# Altium schematic sheet AnanasSTM32.SchDoc: AnanasSTM32
size A3
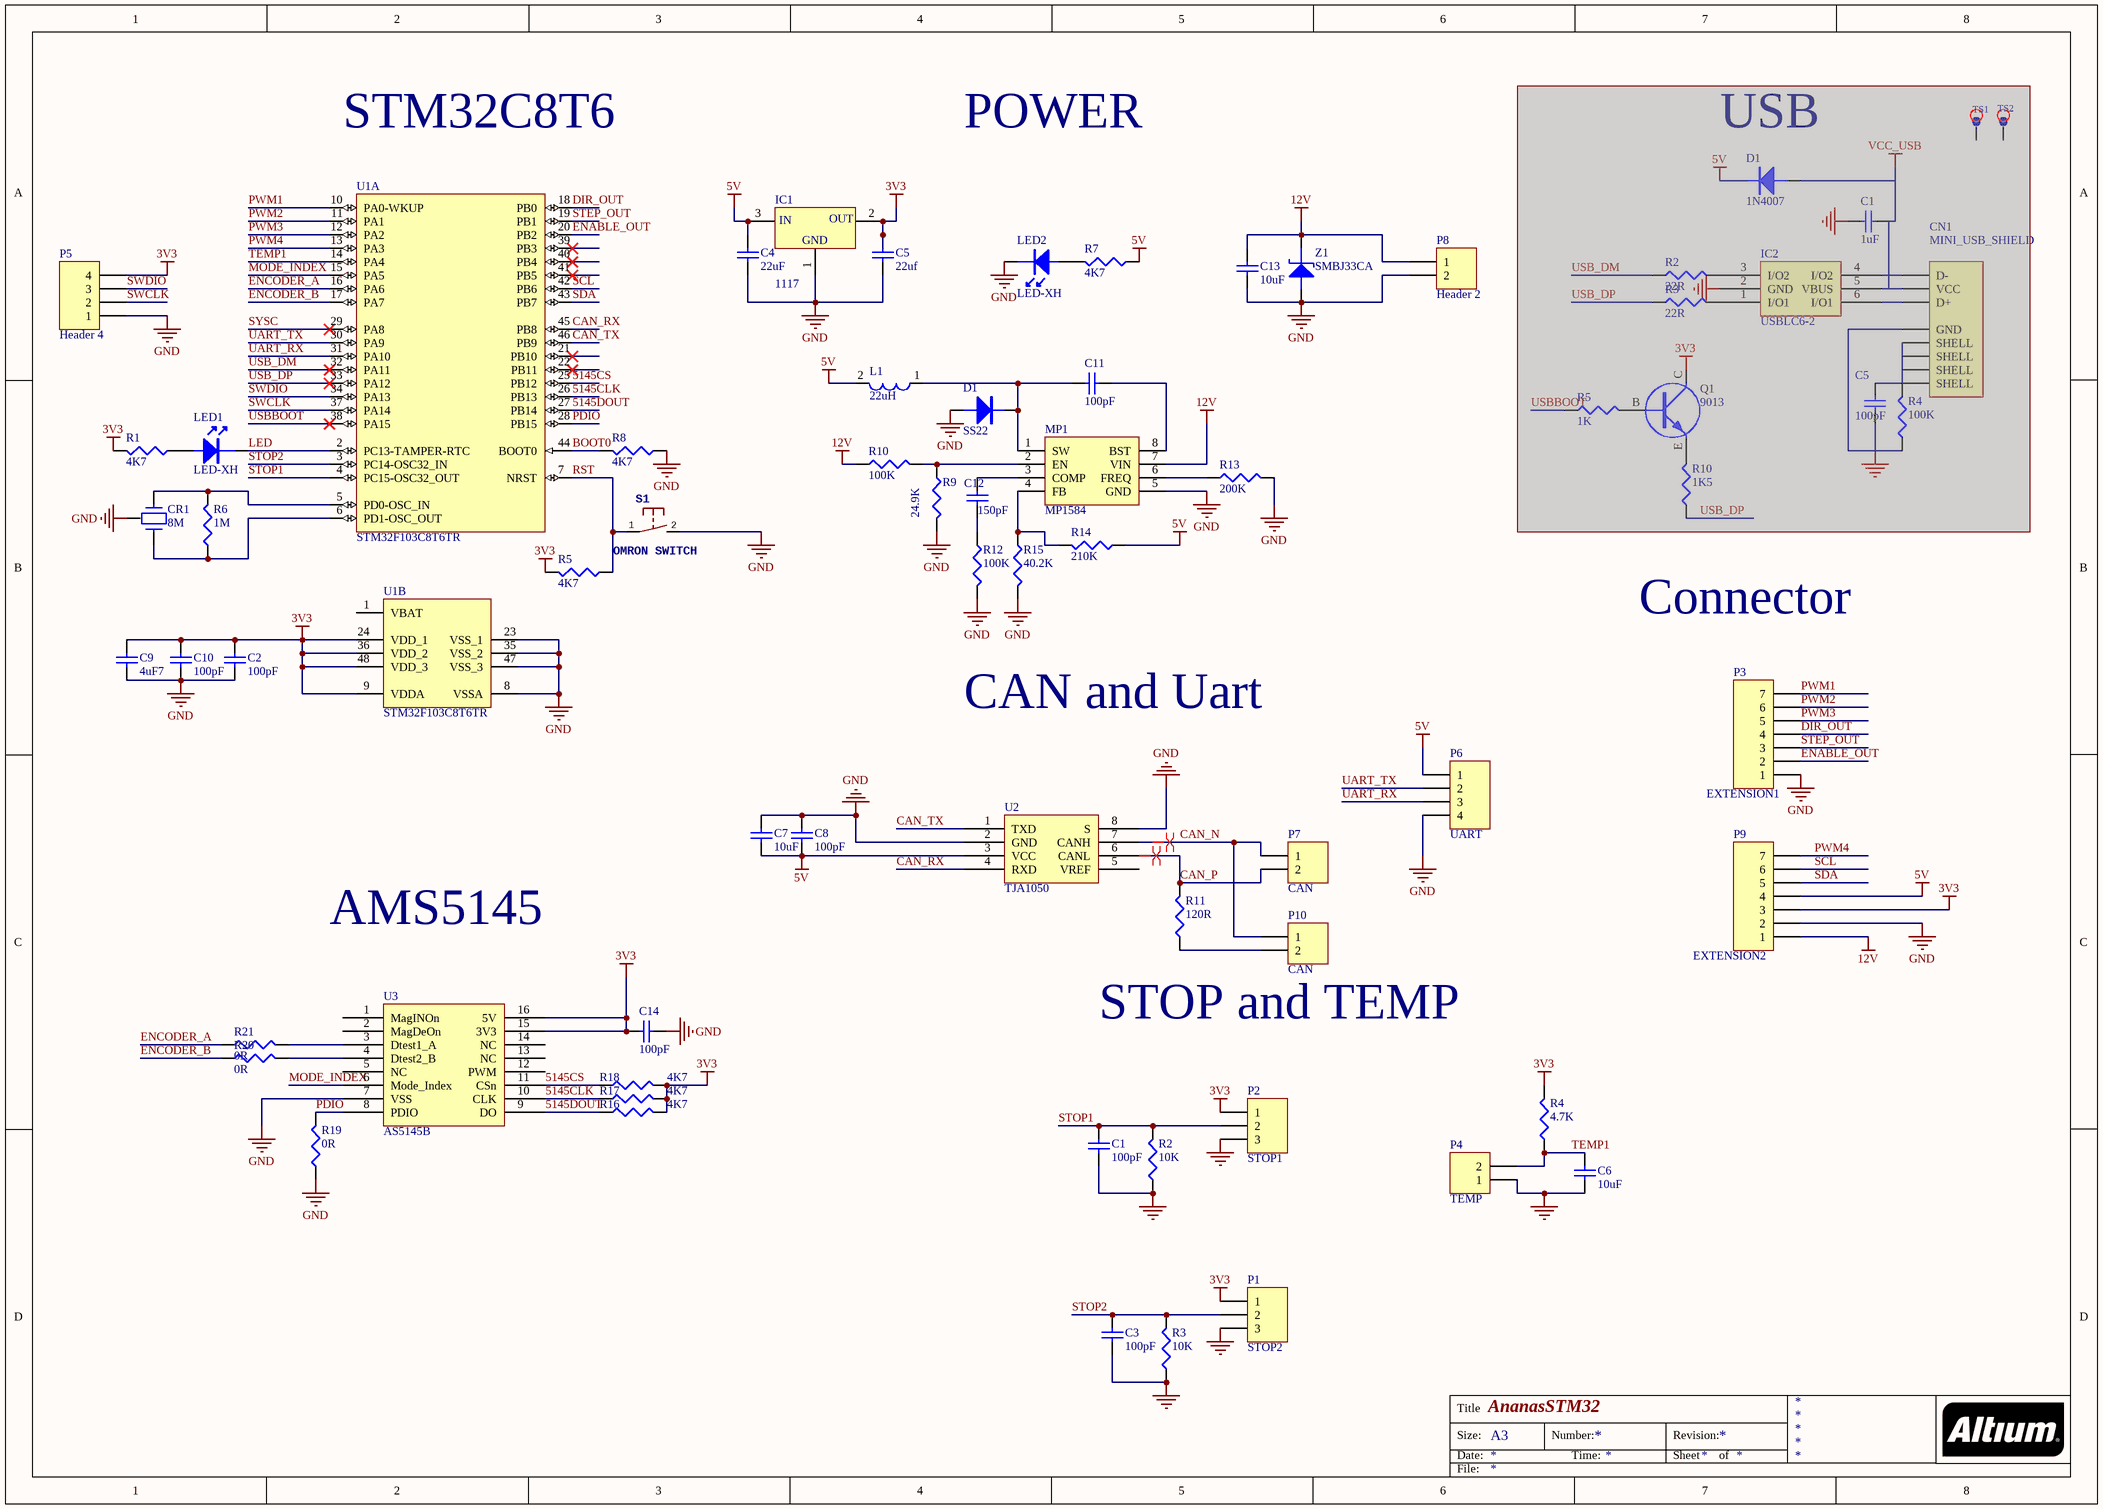
[diagram p0: AnanasSTM32.SchDoc]

## Parts
(Parts that share a designator on the sheet are numbered #1, #2 ... from top to bottom, then left to right.)
C1#1  1uF  [J1-0603]  (masked out: inside a compile mask, not in the netlist)
C1#2  100pF  [J1-0603]
C2  100pF  [J1-0603]
C3  100pF  [J1-0603]
C4  22uF  [C1206]
C5#1  22uf  [C1206]
C5#2  100pF  [J1-0603]  (masked out: inside a compile mask, not in the netlist)
C6  10uF  [J1-0603]
C7  10uF  [1608[0603]]
C8  100pF  [J1-0603]
C9  4uF7  [J1-0603]
C10  100pF  [J1-0603]
C11  100pF  [J1-0603]
C12  150pF  [J1-0603]
C13  10uF  [C1206]
C14  100pF  [J1-0603]
CN1  MINI_USB_SHIELD  [MICRO_USB]  (masked out: inside a compile mask, not in the netlist)
CR1  8M  [CSTCE8M]
D1#1  1N4007  [SOD-123FL]  (masked out: inside a compile mask, not in the netlist)
D1#2  SS22  [SOD-6]
IC1  1117  [SOT-223]
IC2  USBLC6-2  [SOT-23-6]  (masked out: inside a compile mask, not in the netlist)
L1  22uH  [L74]
LED1  LED-XH  [LED-0603]
LED2  LED-XH  [LED-0603]
MP1  MP1584  [LC-SOIC-8_150mil]
P1  STOP2  [HDR1X3]
P2  STOP1  [HDR1X3]
P3  EXTENSION1  [HDR1X7]
P4  TEMP  [HDR1X2]
P5  Header 4  [HDR1X4]
P6  UART  [HDR1X4]
P7  CAN  [HDR1X2]
P8  Header 2  [HDR1X2]
P9  EXTENSION2  [HDR1X7]
P10  CAN  [HDR1X2]
Q1  9013  [SOT23]  (masked out: inside a compile mask, not in the netlist)
R1  4K7  [J1-0603]
R2#1  22R  [J1-0603]  (masked out: inside a compile mask, not in the netlist)
R2#2  10K  [J1-0603]
R3#1  22R  [J1-0603]  (masked out: inside a compile mask, not in the netlist)
R3#2  10K  [J1-0603]
R4#1  100K  [J1-0603]  (masked out: inside a compile mask, not in the netlist)
R4#2  4.7K  [J1-0603]
R5#1  1K  [J1-0603]  (masked out: inside a compile mask, not in the netlist)
R5#2  4K7  [J1-0603]
R6  1M  [J1-0603]
R7  4K7  [J1-0603]
R8  4K7  [J1-0603]
R9  24.9K  [J1-0603]
R10#1  100K  [J1-0603]
R10#2  1K5  [J1-0603]  (masked out: inside a compile mask, not in the netlist)
R11  120R  [J1-0603]
R12  100K  [J1-0603]
R13  200K  [J1-0603]
R14  210K  [J1-0603]
R15  40.2K  [J1-0603]
R16  4K7  [J1-0603]
R17  4K7  [J1-0603]
R18  4K7  [J1-0603]
R19  0R  [J1-0603]
R20  0R  [J1-0603]
R21  0R  [J1-0603]
S1  OMRON SWITCH  [B3F-31XX]
TS1  (no value)  [T-PIN]  (masked out: inside a compile mask, not in the netlist)
TS2  (no value)  [T-PIN]  (masked out: inside a compile mask, not in the netlist)
U1  STM32F103C8T6TR  [STM-LQFP48_N]  (parts A,B of 2)
U2  TJA1050  [LC-SOIC-8_150mil]
U3  AS5145B  [SSOP16_M]
Z1  SMBJ33CA  [D1210]

## Nets
3V3: C2.2 C5#1.2 C9.2 C10.2 C14.2 IC1.2(VOUT) P1.1 P2.1 P5.4 P9.3 R1.2 R4#2.2 R5#2.2 R16.2 R17.2 R18.2 U1.9(VDDA) U1.24(VDD_1) U1.36(VDD_2) U1.48(VDD_3) U3.15(3V3) U3.16(5V)
5V: C4.2 C7.1 C8.1 IC1.3(VIN) L1.2 P6.1 P9.4 R7.1 R14.1 U2.3(VCC)
12V: C13.2 MP1.7(VIN) P8.1 P9.1 R10#1.1 Z1.K
GND: C1#2.1 C2.1 C3.1 C4.1 C5#1.1 C6.1 C7.2 C8.2 C9.1 C10.1 C13.1 C14.1 CR1.2 D1#2.A IC1.1(GND) LED2.K MP1.5(GND) P1.3 P2.3 P3.1 P4.1 P5.1 P6.4 P8.2 P9.2 R2#2.1 R3#2.1 R8.1 R9.2 R12.2 R13.2 R15.2 R19.1 S1.2(S) U1.8(VSSA) U1.23(VSS_1) U1.35(VSS_2) U1.47(VSS_3) U2.2(GND) U2.8(S) U3.7(VSS) Z1.A
5145CLK: R17.1 U1.26(PB13) U3.10(CLK)
5145CS: R18.1 U1.25(PB12) U3.11(CSn)
5145DOUT: R16.1 U1.27(PB14) U3.9(DO)
BOOT0: R8.2 U1.44(BOOT0)
CAN_N: P7.1 P10.1 U2.7(CANH)
CAN_P: P7.2 R11.2 U2.6(CANL)
CAN_RX: U1.45(PB8) U2.4(RXD)
CAN_TX: U1.46(PB9) U2.1(TXD)
DIR_OUT: P3.4 U1.18(PB0)
ENABLE_OUT: P3.2 U1.20(PB2)
ENCODER_A: R21.1 U1.16(PA6)
ENCODER_B: R20.1 U1.17(PA7)
LED: LED1.K U1.2(PC13-TAMPER-RTC)
MODE_INDEX: U1.15(PA5) U3.6(Mode_Index)
PDIO: R19.2 U1.28(PB15) U3.8(PDIO)
PWM1: P3.7 U1.10(PA0-WKUP)
PWM2: P3.6 U1.11(PA1)
PWM3: P3.5 U1.12(PA2)
PWM4: P9.7 U1.13(PA3)
RST: R5#2.1 S1.1(P) U1.7(NRST)
SCL: P9.6 U1.42(PB6)
SDA: P9.5 U1.43(PB7)
STEP_OUT: P3.3 U1.19(PB1)
STOP1: C1#2.2 P2.2 R2#2.2 U1.4(PC15-OSC32_OUT)
STOP2: C3.2 P1.2 R3#2.2 U1.3(PC14-OSC32_IN)
SWCLK: P5.2 U1.37(PA14)
SWDIO: P5.3 U1.34(PA13)
SYSC: U1.29(PA8)
TEMP1: C6.2 P4.2 R4#2.1 U1.14(PA4)
UART_RX: P6.3 U1.31(PA10)
UART_TX: P6.2 U1.30(PA9)
USB_DM: U1.32(PA11)
USB_DP: U1.33(PA12)
USBBOOT: U1.38(PA15)
NetC11_1: C11.1 MP1.8(BST)
NetC11_2: C11.2 D1#2.K L1.1 MP1.1(SW)
NetC12_1: C12.1 R12.1
NetC12_2: C12.2 MP1.3(COMP)
NetCR1_1: CR1.1 R6.2 U1.5(PD0-OSC_IN)
NetCR1_3: CR1.3 R6.1 U1.6(PD1-OSC_OUT)
NetLED1_A: LED1.A R1.1
NetLED2_A: LED2.A R7.2
NetMP1_2: MP1.2(EN) R9.1 R10#1.2
NetMP1_4: MP1.4(FB) R14.2 R15.1
NetMP1_6: MP1.6(FREQ) R13.1
NetP10_2: P10.2 R11.1
NetR20_2: R20.2 U3.4(Dtest2_B)
NetR21_2: R21.2 U3.3(Dtest1_A)

Not connected (* = marked no-connect by the designer): U1 1(VBAT) 21(PB10)* 22(PB11)* 39(PB3)* 40(PB4)* 41(PB5)*; U2 5(VREF); U3 1(MagINOn) 2(MagDeOn) 5(NC) 12(PWM) 13(NC) 14(NC)

## Layout directives
differential pair: CAN_N, CAN_P

## Notes on the sheet
- STM32C8T6
- POWER
- (near D1#1) USB
- Connector
- CAN and Uart
- AMS5145
- STOP and TEMP
- Title
- Size:
- Date:
- A3
- Number:
- Time:
- Revision:
- Sheet
- of
- File:
- (in symbol 1117) IN; OUT

## Library data of the parts
C1#1 C1#2 C2-C4 C5#1 C5#2 C6-C14 = Cap Semi: Capacitor (Semiconductor SIM Model); Published: 8-Jun-2000; LatestRevisionDate: 29-May-2009; LatestRevisionNote: IPC-7351 Footprint Added.; PackageReference: C1206; Publisher: Altium Limited; PackageDescription: Chip Capacitor
  C1#1: Value: 1uF
  C1#2 C2 C3 C5#2 C8 C10 C11 C14: Value: 100pF
  C4: Value: 22uF
  C5#1: Value: 22uf
  C6 C7 C13: Value: 10uF
  C9: Value: 4uF7
  C12: Value: 150pF
CN1 = MINI_USB_SHIELD: MINI USB; Text Field1: MOLEX-47346-0001; Text Field5: 1; Text Field8: 常规件
CR1 = CSTCE8M: 陶振; Text Field2: 8MHz; Text Field4: muRata; Text Field5: 1; Text Field8: 常规; Text Field1: CSTCE8M
D1#1 = 1N4007: 二极管; Text Field2: 1A/1000V; Text Field3: DO-41; Text Field4: HY/HB; Text Field5: 1; Text Field8: 常规; Text Field1: 1N4007; IN4007: *; 1A/1000V: *; DO-41: *; HY/HB: *; 1: *; CG: *
D1#2 = 1N4001: 二极管; Text Field1: IN4001; Text Field2: 1A/50V; Text Field3: DO-41; Text Field4: HY/HB; Text Field5: 1; Text Field8: 常规; IN4001: *; 1A/50V: *; DO-41: *; HY/HB: *; 1: *; CG: *
IC1 = 1117: 三端稳压器; Text Field1: LM7805CT; Text Field2: 5V; Text Field3: TO-220AB; Text Field4: NS/ON/ST; Text Field5: 1; Text Field8: 通用
IC2 = USBLC6-2: ESD PROTECTION; Text Field3: SOT23-6; Text Field5: 1; Text Field8: 特殊; Text Field1: USBLC6-2
L1 = L: 电流互感器; Text Field1: 0057W; Text Field2: 25A; Text Field4: 上虞电子; Text Field5: 1; Text Field8: 定制
LED1 LED2 = LED-XH: 发光二极管; Text Field1: TL-25035T; Text Field2: 高黄; Text Field3: 2*5; Text Field4: 天星; Text Field5: 1; Text Field8: 通用
P1 P2 = Header 3: Header, 3-Pin; LatestRevisionDate: 17-Jul-2002; LatestRevisionNote: Re-released for DXP Platform.; Publisher: Altium Limited
P3 P9 = Header 7: Header, 7-Pin; LatestRevisionDate: 17-Jul-2002; LatestRevisionNote: Re-released for DXP Platform.; Publisher: Altium Limited
P4 P7 P8 P10 = Header 2: Header, 2-Pin; LatestRevisionDate: 17-Jul-2002; LatestRevisionNote: Re-released for DXP Platform.; Publisher: Altium Limited
P5 P6 = Header 4: Header, 4-Pin; LatestRevisionDate: 17-Jul-2002; LatestRevisionNote: Re-released for DXP Platform.; Publisher: Altium Limited
Q1 = 9013: 三极管; Text Field2: A级; Text Field5: 1; Text Field8: 常规; Text Field1: 9013; Text Field3: SOT23; KTC9013: *; A级: *; TO-92A: *; KEC: *; 1: *; CG: *
R1 R2#1 R2#2 R3#1 R3#2 R4#1 R4#2 R5#1 R5#2 R6-R9 R10#1 R10#2 R11-R21 = Res3: Resistor; Published: 8-Jun-2000; LatestRevisionDate: 29-May-2009; LatestRevisionNote: IPC-7351 Footprint Added.; PackageReference: J1-0603; Publisher: Altium Limited; PackageDescription: Chip Resistor
  R1 R5#2 R7 R8 R16-R18: Value: 4K7
  R2#1 R3#1: Value: 22R
  R2#2 R3#2: Value: 10K
  R4#1 R10#1 R12: Value: 100K
  R4#2: Value: 4.7K
  R5#1: Value: 1K
  R6: Value: 1M
  R9: Value: 24.9K
  R10#2: Value: 1K5
  R11: Value: 120R
  R13: Value: 200K
  R14: Value: 210K
  R15: Value: 40.2K
  R19-R21: Value: 0R
S1 = 31-XX: MPN: B3F-3100; OC_FARNELL: 959704; OC_NEWARK: 36M3582
TS1 TS2 = T-PIN
U1 = STM32F103C8T6TR: ARM Cortex-M3 32-bit MCU, 64 KB Flash, 20 KB Internal RAM, 37 I/Os, 48-pin LQFP, -40 to 85 degC, Tape and Reel; A/D Converter: 2x12-bit (10 Channel); FLASH Size (Prog) (kB): 64; I/Os (High Current): 37; Internal RAM Size (kB): 20; Operating Frequency(F) (Processor speed) (MHz): 72; Supply Voltage(Vcc) min (V): 2; DatasheetVersion: Rev. 16; PackageVersion: Rev. 6, 06/2013; PackageReference: LQFP48; PackageDescription: 48-Pin Low Profile Quad Flat Package, 7 x 7 mm Body, 0.5 mm Pitch; Supplier 1: Digi-Key; Supplier Part Number 1: STM32F103C8T6TR-ND; Supplier 2: Mouser; Supplier Part Number 2: 511-STM32F103C8T6TR; Core: ARM Cortex-M3; Packing: Tape and Reel; Mounting Technology: Surface Mount; PartNumber: STM32F103C8T6TR; ComponentLink1Description: Manufacturer URL; ComponentLink1URL: http://www.st.com/web/en/home.html; ComponentLink2Description: Datasheet; ComponentLink2URL: http://www.st.com/st-web-ui/static/active/en/resource/technical/document/datasheet/CD00161566.pdf; ComponentLink3Description: Package Specification; ComponentLink3URL: http://www.st.com/st-web-ui/static/active/en/resource/technical/document/datasheet/DM00058181.pdf
Z1 = 1N4733A: 稳压管; Text Field1: IN4733; Text Field2: 5V/1W; Text Field3: DO-41G; Text Field4: HY/HB; Text Field5: 1; Text Field8: CG; IN4733: *; 5V/1W: *; DO-41G: *; HY/HB: *; 1: *; CG: *